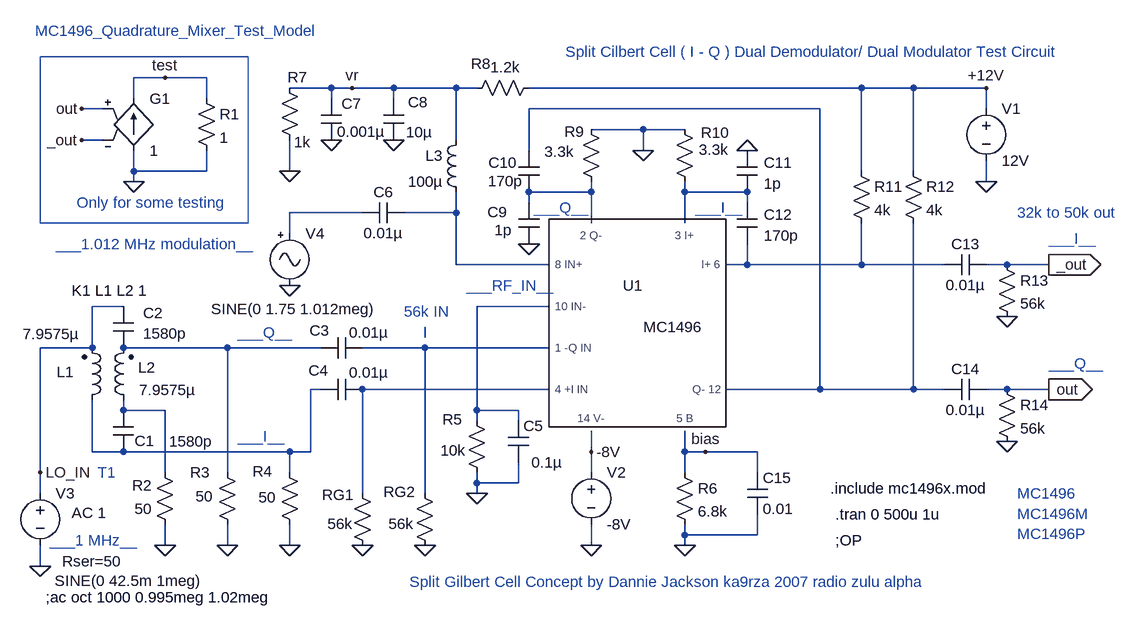
[diagram p0: schematic 12_KHz_Offset_Test_2.asc]
12_KHz_Offset_Test_2.asc, the LTspice schematic file:
Version 4
SHEET 1 1672 1236
WIRE -992 -320 -1040 -320
WIRE -928 -320 -992 -320
WIRE -736 -304 -800 -304
WIRE -704 -304 -736 -304
WIRE -640 -304 -704 -304
WIRE -544 -304 -640 -304
WIRE -512 -304 -544 -304
WIRE 80 -304 -432 -304
WIRE 160 -304 80 -304
WIRE 272 -304 160 -304
WIRE -1040 -288 -1040 -320
WIRE -928 -288 -928 -320
WIRE -736 -288 -736 -304
WIRE -640 -288 -640 -304
WIRE -1088 -272 -1120 -272
WIRE 16 -272 -432 -272
WIRE 272 -272 272 -304
WIRE -256 -240 -336 -240
WIRE -192 -240 -256 -240
WIRE -1088 -224 -1120 -224
WIRE -544 -224 -544 -304
WIRE -432 -208 -432 -272
WIRE -256 -208 -256 -240
WIRE -1040 -176 -1040 -208
WIRE -928 -176 -928 -208
WIRE -928 -176 -1040 -176
WIRE -800 -176 -800 -224
WIRE 80 -176 80 -304
WIRE 160 -176 160 -304
WIRE -1040 -160 -1040 -176
WIRE 272 -160 272 -192
WIRE -336 -144 -336 -160
WIRE -336 -144 -432 -144
WIRE -192 -144 -192 -160
WIRE -96 -144 -192 -144
WIRE -432 -128 -432 -144
WIRE -96 -128 -96 -144
WIRE -688 -112 -800 -112
WIRE -544 -112 -544 -144
WIRE -544 -112 -624 -112
WIRE -336 -96 -336 -144
WIRE -192 -96 -192 -144
WIRE -800 -80 -800 -112
WIRE -544 -32 -544 -112
WIRE -400 -32 -544 -32
WIRE -96 -32 -96 -64
WIRE -96 -32 -128 -32
WIRE 80 -32 80 -96
WIRE 80 -32 -96 -32
WIRE 208 -32 80 -32
WIRE 304 -32 272 -32
WIRE 368 -32 304 -32
WIRE -1056 32 -1104 32
WIRE -400 32 -512 32
WIRE -592 80 -592 64
WIRE -1104 96 -1104 32
WIRE -1104 96 -1184 96
WIRE -896 96 -1056 96
WIRE -752 96 -896 96
WIRE -592 96 -688 96
WIRE -400 96 -592 96
WIRE -752 160 -768 160
WIRE -400 160 -688 160
WIRE 16 160 16 -272
WIRE 16 160 -128 160
WIRE 160 160 160 -96
WIRE 160 160 16 160
WIRE 208 160 160 160
WIRE 304 160 272 160
WIRE 368 160 304 160
WIRE -1056 192 -1056 176
WIRE -992 192 -1056 192
WIRE -512 192 -512 32
WIRE -448 192 -512 192
WIRE -512 208 -512 192
WIRE -448 208 -448 192
WIRE -1104 256 -1104 176
WIRE -1056 256 -1104 256
WIRE -800 256 -1056 256
WIRE -768 256 -768 160
WIRE -768 256 -800 256
WIRE -336 256 -336 224
WIRE -192 256 -192 224
WIRE -160 256 -192 256
WIRE -80 256 -160 256
WIRE -1184 288 -1184 96
WIRE -992 288 -992 192
WIRE -896 288 -896 96
WIRE -800 288 -800 256
WIRE -336 288 -336 256
WIRE -192 288 -192 256
WIRE -80 288 -80 256
WIRE -512 304 -512 288
WIRE -448 304 -448 272
WIRE -448 304 -512 304
WIRE -1184 320 -1184 288
WIRE -688 320 -688 160
WIRE -592 320 -592 96
WIRE -512 320 -512 304
WIRE -192 384 -192 368
WIRE -80 384 -80 352
WIRE -80 384 -192 384
WIRE -992 400 -992 368
WIRE -896 400 -896 368
WIRE -800 400 -800 368
WIRE -336 400 -336 368
WIRE -192 400 -192 384
WIRE -1184 432 -1184 400
FLAG 272 -160 0
FLAG -336 400 0
FLAG -336 256 -8V
FLAG 272 -304 +12V
FLAG -896 400 0
FLAG -704 -304 vr
FLAG -1184 432 0
FLAG -1040 -160 0
FLAG -992 -320 test
FLAG -1120 -224 _out
FLAG -1120 -272 out
FLAG -800 400 0
FLAG -800 -176 0
FLAG 368 -32 _out
IOPIN 368 -32 Out
FLAG 368 160 out
IOPIN 368 160 Out
FLAG -160 256 bias
FLAG -1184 288 LO_IN
FLAG -192 400 0
FLAG -992 400 0
FLAG 304 48 0
FLAG 304 240 0
FLAG -256 -208 0
FLAG -512 320 0
FLAG -640 -224 0
FLAG -96 -208 0
FLAG -432 -64 0
FLAG -736 -224 0
FLAG -592 400 0
FLAG -688 400 0
FLAG -800 0 0
SYMBOL voltage 272 -288 R0
WINDOW 123 0 0 Left 0
WINDOW 39 0 0 Left 0
SYMATTR InstName V1
SYMATTR Value 12V
SYMBOL voltage -336 272 R0
WINDOW 123 0 0 Left 0
WINDOW 39 0 0 Left 0
SYMATTR InstName V2
SYMATTR Value -8V
SYMBOL res -912 272 R0
WINDOW 0 -41 16 Left 0
WINDOW 3 -33 53 Left 0
SYMATTR InstName R3
SYMATTR Value 50
SYMBOL res 64 -192 R0
SYMATTR InstName R11
SYMATTR Value 4k
SYMBOL res 144 -192 R0
SYMATTR InstName R12
SYMATTR Value 4k
SYMBOL res -944 -304 R0
SYMATTR InstName R1
SYMATTR Value 1
SYMBOL g -1040 -304 R0
SYMATTR InstName G1
SYMATTR Value 1
SYMBOL res -208 272 R0
SYMATTR InstName R6
SYMATTR Value 6.8k
SYMBOL res -816 272 R0
WINDOW 0 -41 14 Left 0
WINDOW 3 -32 54 Left 0
SYMATTR InstName R4
SYMATTR Value 50
SYMBOL voltage -1184 304 R0
WINDOW 3 22 151 Left 0
WINDOW 123 48 46 Left 0
WINDOW 39 34 121 Left 0
SYMATTR Value SINE(0 42.5m 1meg)
SYMATTR Value2 AC 1
SYMATTR SpiceLine Rser=50
SYMATTR InstName V3
SYMBOL res -528 -288 R270
WINDOW 0 38 22 VTop 0
WINDOW 3 64 60 VBottom 0
SYMATTR InstName R8
SYMATTR Value 1.2k
SYMBOL res -816 -320 R0
WINDOW 0 13 -1 Left 0
WINDOW 3 23 99 Left 0
SYMATTR InstName R7
SYMATTR Value 1k
SYMBOL mc1496 -256 64 R0
SYMATTR InstName U1
SYMBOL res -352 -256 R0
WINDOW 0 -25 19 Left 0
WINDOW 3 -56 50 Left 0
SYMATTR InstName R9
SYMATTR Value 3.3k
SYMBOL res -208 -256 R0
WINDOW 0 41 21 Left 0
WINDOW 3 38 47 Left 0
SYMATTR InstName R10
SYMATTR Value 3.3k
SYMBOL cap 272 -48 R90
WINDOW 0 0 32 VBottom 0
WINDOW 3 32 32 VTop 0
SYMATTR InstName C13
SYMATTR Value 0.01µ
SYMBOL cap 272 144 R90
WINDOW 0 0 32 VBottom 0
WINDOW 3 32 32 VTop 0
SYMATTR InstName C14
SYMATTR Value 0.01µ
SYMBOL res -672 416 R180
WINDOW 0 29 94 Left 0
WINDOW 3 31 49 Left 0
SYMATTR InstName RG1
SYMATTR Value 56k
SYMBOL res -576 416 R180
WINDOW 0 30 98 Left 0
WINDOW 3 33 49 Left 0
SYMATTR InstName RG2
SYMATTR Value 56k
SYMBOL ind2 -1120 192 M180
WINDOW 0 -39 59 Left 0
WINDOW 3 -91 117 Left 0
SYMATTR InstName L1
SYMATTR Value 7.9575µ
SYMATTR Type ind
SYMBOL ind2 -1040 192 R180
WINDOW 0 -34 66 Left 0
WINDOW 3 -96 31 Left 0
SYMATTR InstName L2
SYMATTR Value 7.9575µ
SYMATTR Type ind
SYMBOL cap -1072 32 R0
WINDOW 0 46 10 Left 0
WINDOW 3 46 42 Left 0
SYMATTR InstName C2
SYMATTR Value 1580p
SYMBOL res -976 384 R180
WINDOW 0 36 76 Left 0
WINDOW 3 36 40 Left 0
SYMATTR InstName R2
SYMATTR Value 50
SYMBOL cap -1072 192 R0
WINDOW 0 33 47 Left 0
WINDOW 3 86 48 Left 0
SYMATTR InstName C1
SYMATTR Value 1580p
SYMBOL res 288 -48 R0
SYMATTR InstName R13
SYMATTR Value 56k
SYMBOL res 288 144 R0
SYMATTR InstName R14
SYMATTR Value 56k
SYMBOL cap -656 -288 R0
WINDOW 0 38 6 Left 0
WINDOW 3 35 52 Left 0
SYMATTR InstName C8
SYMATTR Value 10µ
SYMBOL res -528 192 R0
WINDOW 0 -37 14 Left 0
WINDOW 3 -40 62 Left 0
SYMATTR InstName R5
SYMATTR Value 10k
SYMBOL cap -464 208 R0
WINDOW 3 36 64 Left 0
SYMATTR Value 0.1µ
SYMATTR InstName C5
SYMBOL cap -112 -208 R0
WINDOW 0 42 19 Left 0
WINDOW 3 42 51 Left 0
SYMATTR InstName C11
SYMATTR Value 1p
SYMBOL cap -112 -128 R0
WINDOW 0 42 19 Left 0
WINDOW 3 42 51 Left 0
SYMATTR InstName C12
SYMATTR Value 170p
SYMBOL cap -416 -128 M0
WINDOW 0 49 15 Left 0
WINDOW 3 42 43 Left 0
SYMATTR InstName C9
SYMATTR Value 1p
SYMBOL cap -448 -208 R0
WINDOW 0 -46 19 Left 0
WINDOW 3 -47 47 Left 0
SYMATTR InstName C10
SYMATTR Value 170p
SYMBOL cap -752 -288 R0
WINDOW 0 32 8 Left 0
WINDOW 3 25 51 Left 0
SYMATTR InstName C7
SYMATTR Value 0.001µ
SYMBOL cap -688 144 R90
WINDOW 0 2 68 VBottom 0
WINDOW 3 -26 -10 VTop 0
SYMATTR InstName C4
SYMATTR Value 0.01µ
SYMBOL cap -688 80 R90
WINDOW 0 5 66 VBottom 0
WINDOW 3 -23 -10 VTop 0
SYMATTR InstName C3
SYMATTR Value 0.01µ
SYMBOL Misc\\signal -800 -96 R0
WINDOW 3 -121 132 Left 0
WINDOW 123 0 0 Left 0
WINDOW 39 0 0 Left 0
SYMATTR Value SINE(0 1.75 1.012meg)
SYMATTR InstName V4
SYMBOL cap -624 -128 R90
WINDOW 0 0 32 VBottom 0
WINDOW 3 32 32 VTop 0
SYMATTR InstName C6
SYMATTR Value 0.01µ
SYMBOL ind -528 -240 M0
SYMATTR InstName L3
SYMATTR Value 100µ
SYMBOL cap -96 288 R0
SYMATTR InstName C15
SYMATTR Value 0.01
TEXT 40 352 Left 0 !.tran 0 500u 1u
TEXT 40 392 Left 0 !;OP
TEXT 32 312 Left 0 !.include mc1496x.mod
TEXT 320 320 Left 0 ;MC1496\nMC1496M\nMC1496P
TEXT -1128 -128 Left 0 ;Only for some testing
TEXT -1176 480 Left 0 !;ac oct 1000 0.995meg 1.02meg
TEXT 368 -72 Left 0 ;___I__
TEXT 368 120 Left 0 ;___Q__
TEXT -880 232 Left 0 ;___I__
TEXT -880 72 Left 0 ;___Q__
TEXT -176 -120 Left 0 ;___I__
TEXT -424 -120 Left 0 ;___Q__
TEXT -376 -360 Left 0 ;Split Cilbert Cell ( I - Q ) Dual Demodulator/ Dual Modulator Test Circuit
TEXT -528 0 Left 0 ;___RF_IN__
TEXT -1136 8 Left 0 !K1 L1 L2 1
TEXT 320 -112 Left 0 ;32k to 50k out
TEXT -1096 288 Left 0 ;T1
TEXT -1192 -392 Left 0 ;MC1496_Quadrature_Mixer_Test_Model
TEXT -1032 392 Right 0 ;___1 MHz__
TEXT -624 40 Left 0 ;56k IN
TEXT -616 456 Left 0 ;Split Gilbert Cell Concept by Dannie Jackson ka9rza 2007 radio zulu alpha
TEXT -1160 -64 Left 0 ;___1.012 MHz modulation__
RECTANGLE Normal -864 -96 -1184 -352

The netlist it stands for:
* 12_KHz_Offset_Test_2.asc
V1 +12V 0 12V
V2 -8V 0 -8V
R3 N009 0 50
R11 +12V N006 4k
R12 +12V N001 4k
R1 test 0 1
G1 0 test out _out 1
R6 bias 0 6.8k
R4 N011 0 50
V3 LO_IN 0 SINE(0 42.5m 1meg) AC 1 Rser=50
R8 vr +12V 1.2k
R7 vr 0 1k
XU1 N005 N007 N010 N012 N002 N003 -8V bias N006 N001 MC1496  ; pins 8_IN+ 10_IN- 1_-Q_IN 4_+I_IN 2_Q- 3_I+ 14_V- 5_B I+_6 Q-_12
R9 0 N002 3.3k
R10 0 N003 3.3k
C13 _out N006 0.01µ
C14 out N001 0.01µ
RG1 0 N012 56k
RG2 0 N010 56k
L1 N011 LO_IN 7.9575µ
L2 N013 N009 7.9575µ
C2 LO_IN N009 1580p
R2 0 N013 50
C1 N013 N011 1580p
R13 _out 0 56k
R14 out 0 56k
C8 vr 0 10µ
R5 N007 0 10k
C5 N007 0 0.1µ
C11 0 N003 1p
C12 N003 N006 170p
C9 N002 0 1p
C10 N001 N002 170p
C7 vr 0 0.001µ
C4 N012 N011 0.01µ
C3 N010 N009 0.01µ
V4 N004 0 SINE(0 1.75 1.012meg)
C6 N005 N004 0.01µ
L3 vr N005 100µ
C15 bias 0 0.01
.tran 0 500u 1u
;OP
.include mc1496x.mod
* MC1496
* MC1496M
* MC1496P
* Only for some testing
;ac oct 1000 0.995meg 1.02meg
* ___I__
* ___Q__
* ___I__
* ___Q__
* ___I__
* ___Q__
* Split Cilbert Cell ( I - Q ) Dual Demodulator/ Dual Modulator Test Circuit
* ___RF_IN__
K1 L1 L2 1
* 32k to 50k out
* T1
* MC1496_Quadrature_Mixer_Test_Model
* ___1 MHz__
* 56k IN
* Split Gilbert Cell Concept by Dannie Jackson ka9rza 2007 radio zulu alpha
* ___1.012 MHz modulation__
.backanno
.end